# EAGLE design nodemcu (EAGLE 7.3.0)
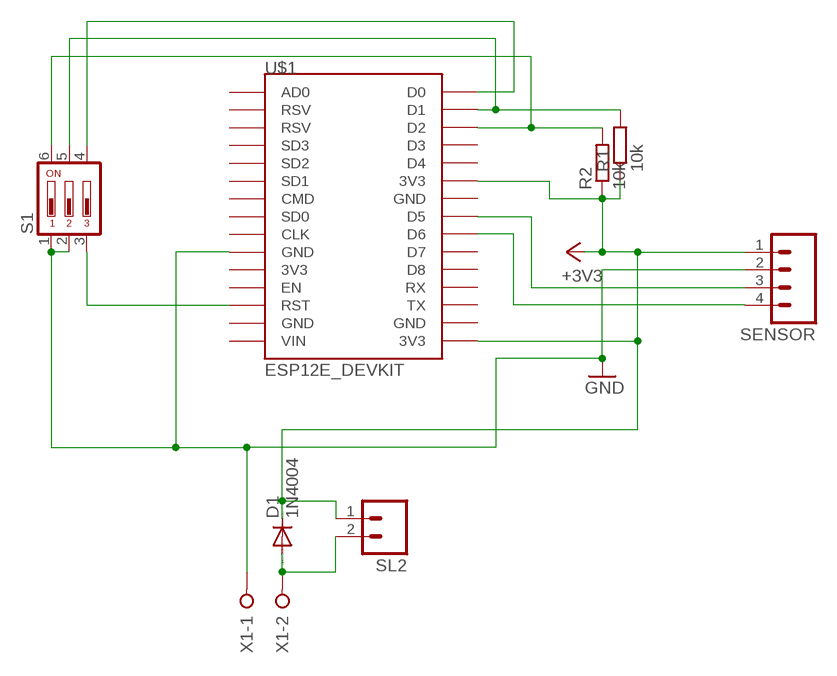
[diagram p0: schematic, sheet 1]

## Parts
D1  1N4004  [DO41-10]
R1  10k  R-EU_0207/10  [0207/10]
R2  10k  R-EU_0207/10  [0207/10]
S1  DIP03YL  [DIP03YL]
SENSOR  M04  [04P]
SL2  M02  [02P]
U$1  ESP12E_DEVKIT  [ESP12E_DEVKIT]
X1  W237-02P  [W237-132]

## Nets
+3V3: D1.C R1.1 R2.1 SENSOR.1 SL2.1 U$1.3V3@1(3V3) U$1.3V3@2(3V3)
GND: S1.1 S1.2 SENSOR.2 U$1.GND@0(GND) X1.1
N$1: S1.4 U$1.D0
N$2: SENSOR.4 U$1.D6
N$3: SENSOR.3 U$1.D5
N$4: S1.3 U$1.RST
N$5: D1.A SL2.2 X1.2
N$8: R1.2 S1.5 U$1.D1
N$9: R2.2 S1.6 U$1.D2
Unconnected: U$1.3V3@0(3V3) U$1.AD0 U$1.CLK U$1.CMD U$1.D3 U$1.D4 U$1.D7 U$1.D8 U$1.EN U$1.GND@1(GND) U$1.GND@2(GND) U$1.GND@3(GND) U$1.RSV@0(RSV) U$1.RSV@1(RSV) U$1.RX U$1.SD0 U$1.SD1 U$1.SD2 U$1.SD3 U$1.TX U$1.VIN

## Library data of the parts
D1 = diode:1N4004: DIODE general purpose rectifier, 1 A
R1 R2 = rcl:R-EU_: RESISTOR, European symbol
S1 = switch-dil:DIP03YL: DIL/CODE SWITCH; OC_FARNELL: unknown; OC_NEWARK: unknown
SENSOR = con-amp-quick:M04: AMP QUICK CONNECTOR; OC_FARNELL: unknown; OC_NEWARK: unknown
SL2 = con-amp-quick:M02: AMP QUICK CONNECTOR; OC_FARNELL: unknown; OC_NEWARK: unknown
U$1 = nodemcu:ESP12E_DEVKIT: ESP12E DEVKIT BOARD
X1 = con-wago-508:W237-02P: WAGO SREW CLAMP; OC_FARNELL: unknown; OC_NEWARK: unknown

## Board
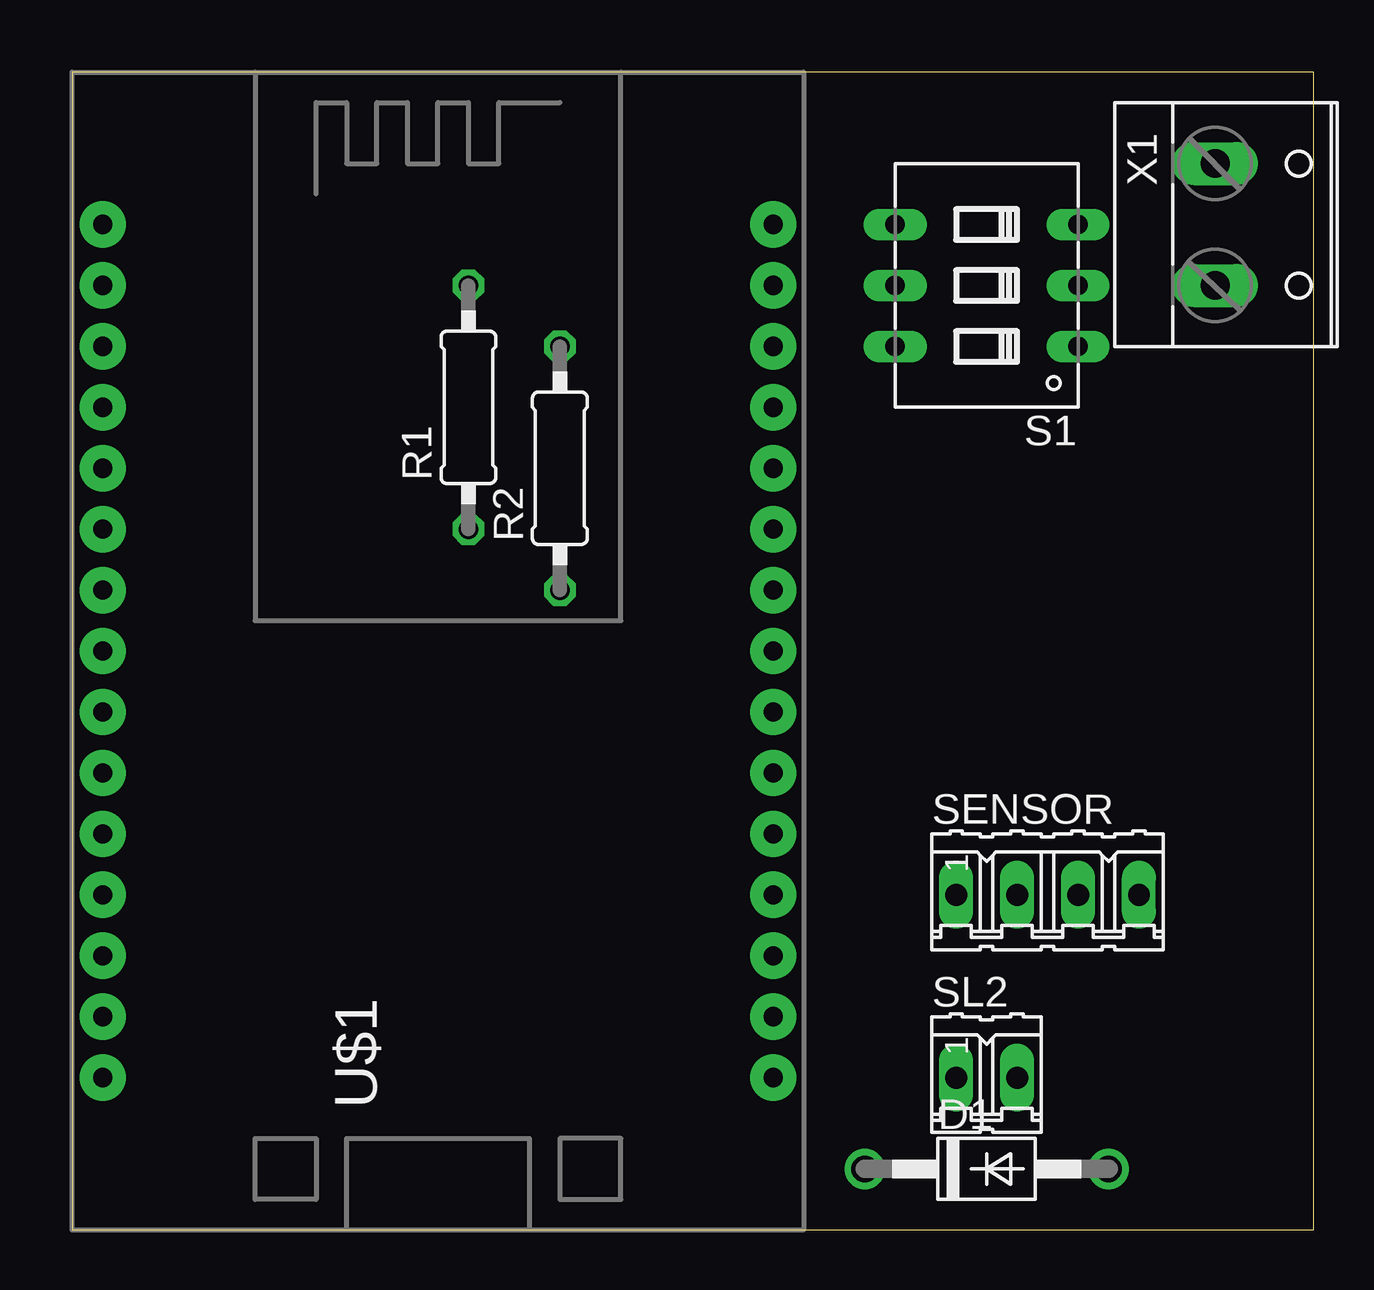
[diagram p1: board, top side]
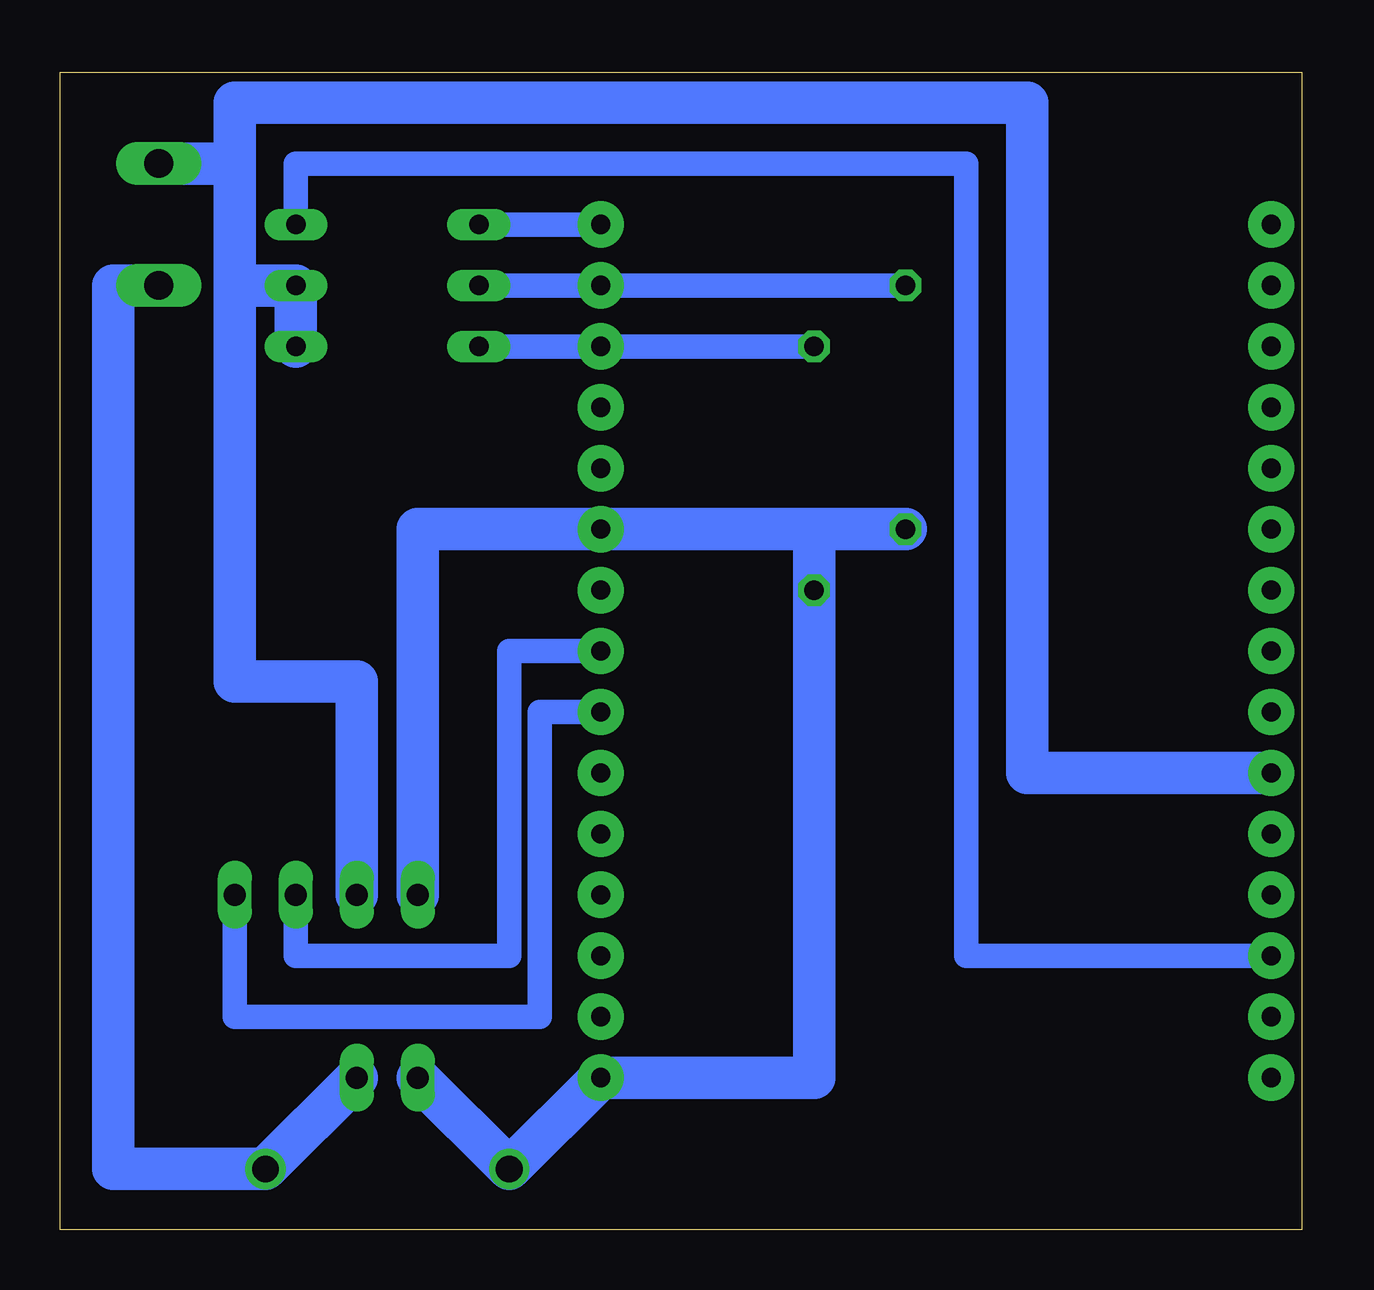
[diagram p2: board, bottom side, seen from below]

Size 51.74 x 48.25 mm. Coordinates in mm from the lower left corner, seen from the top.
Outline: 0,0 51.74,0 51.74,48.25 0,48.25 0,0
Copper layers (1*16): Top 0.035mm / dielectric 1.5mm / Bottom 0.035mm
Design rules "default": minimum track width 10mil, minimum drill 24mil, track to track 8mil, track to pad 8mil, pad to pad 8mil, via to via 8mil, smd to smd 8mil, copper to edge 40mil, drill to drill 8mil, minimum pad ring 10mil, minimum via ring 8mil, stop-mask expansion 4mil, vias tented up to drill 0mil, thermal gap 10mil

### Footprints (pad centres in the part's own frame; a part is rotated, then mirrored left to right if it is on the bottom)
DO41-10 = drill 1.118: A 5.08,0; C -5.08,0
0207/10 = drill 0.813 octagon: 1 -5.08,0; 2 5.08,0
DIP03YL = drill 0.813 long: 1 -2.54,-3.81; 2 0,-3.81; 3 2.54,-3.81; 4 2.54,3.81; 5 0,3.81; 6 -2.54,3.81
04P = drill 0.914 long: 1 -3.81,0; 2 -1.27,0; 3 1.27,0; 4 3.81,0
02P = drill 0.914 long: 1 -1.27,0; 2 1.27,0
ESP12E_DEVKIT = drill 0.8 pad 1.93: 3V3@0 -16.51,-7.62; 3V3@1 11.43,5.08; 3V3@2 11.43,-17.78; AD0 -16.51,17.78; CLK -16.51,-2.54; CMD -16.51,2.54; D0 11.43,17.78; D1 11.43,15.24; D2 11.43,12.7; D3 11.43,10.16; D4 11.43,7.62; D5 11.43,0; D6 11.43,-2.54; D7 11.43,-5.08; D8 11.43,-7.62; EN -16.51,-10.16; GND@0 -16.51,-5.08; GND@1 -16.51,-15.24; GND@2 11.43,2.54; GND@3 11.43,-15.24; RST -16.51,-12.7; RSV@0 -16.51,15.24; RSV@1 -16.51,12.7; RX 11.43,-10.16; SD0 -16.51,0; SD1 -16.51,5.08; SD2 -16.51,7.62; SD3 -16.51,10.16; TX 11.43,-12.7; VIN -16.51,-17.78
W237-132 = drill 1.194 long: 1 -2.54,-0.635; 2 2.54,-0.635

### Placement (x,y rotation side)
D1  38.1,2.54 0 top
R1  16.51,34.29 90 top
R2  20.32,31.75 90 top
S1  38.1,39.37 90 top
SENSOR  40.64,13.97 0 top
SL2  38.1,6.35 0 top
U$1  17.78,24.13 0 top
X1  48.26,41.91 270 top

### Tracks (layer width: path | path; a pad name or v marks a point on that pad's centre or on a via)
+3V3
  Bottom 1.778: SL2.1 D1.C U$1.3V3@2 20.32,6.35 R2.1 20.32,29.21 | 20.32,29.21 R1.1 | SENSOR.1 36.83,29.21 U$1.3V3@1 20.32,29.21
GND
  Bottom 1.778: X1.1 44.45,44.45 | 44.45,44.45 44.45,39.37 | 44.45,39.37 44.45,22.86 39.37,22.86 SENSOR.2 | U$1.GND@0 11.43,19.05 11.43,46.99 44.45,46.99 44.45,44.45 | S1.1 S1.2 44.45,39.37
N$1
  Bottom 1.016: U$1.D0 S1.4
N$2
  Bottom 1.016: SENSOR.4 44.45,8.89 31.75,8.89 31.75,21.59 U$1.D6
N$3
  Bottom 1.016: SENSOR.3 41.91,11.43 33.02,11.43 33.02,24.13 U$1.D5
N$4
  Bottom 1.016: U$1.RST 13.97,11.43 13.97,44.45 41.91,44.45 S1.3
N$5
  Bottom 1.778: X1.2 49.53,39.37 49.53,2.54 D1.A SL2.2
N$8
  Bottom 1.016: R1.2 U$1.D1 S1.5
N$9
  Bottom 1.016: R2.2 U$1.D2 S1.6